# Altium schematic sheet ESC_Mounting.SchDoc
size B; Organization: ORGANIZATION; Address1: ADDRESS 1; Address2: ADDRESS 2; Address3: ADDRESS 3; Address4: ADDRESS 4; Revision: -; SheetNumber: 1; SheetTotal: 2; ENG_APP_DATE: --/--/--; DSN_APP_DATE: --/--/--; CHK_APP_DATE: --/--/--
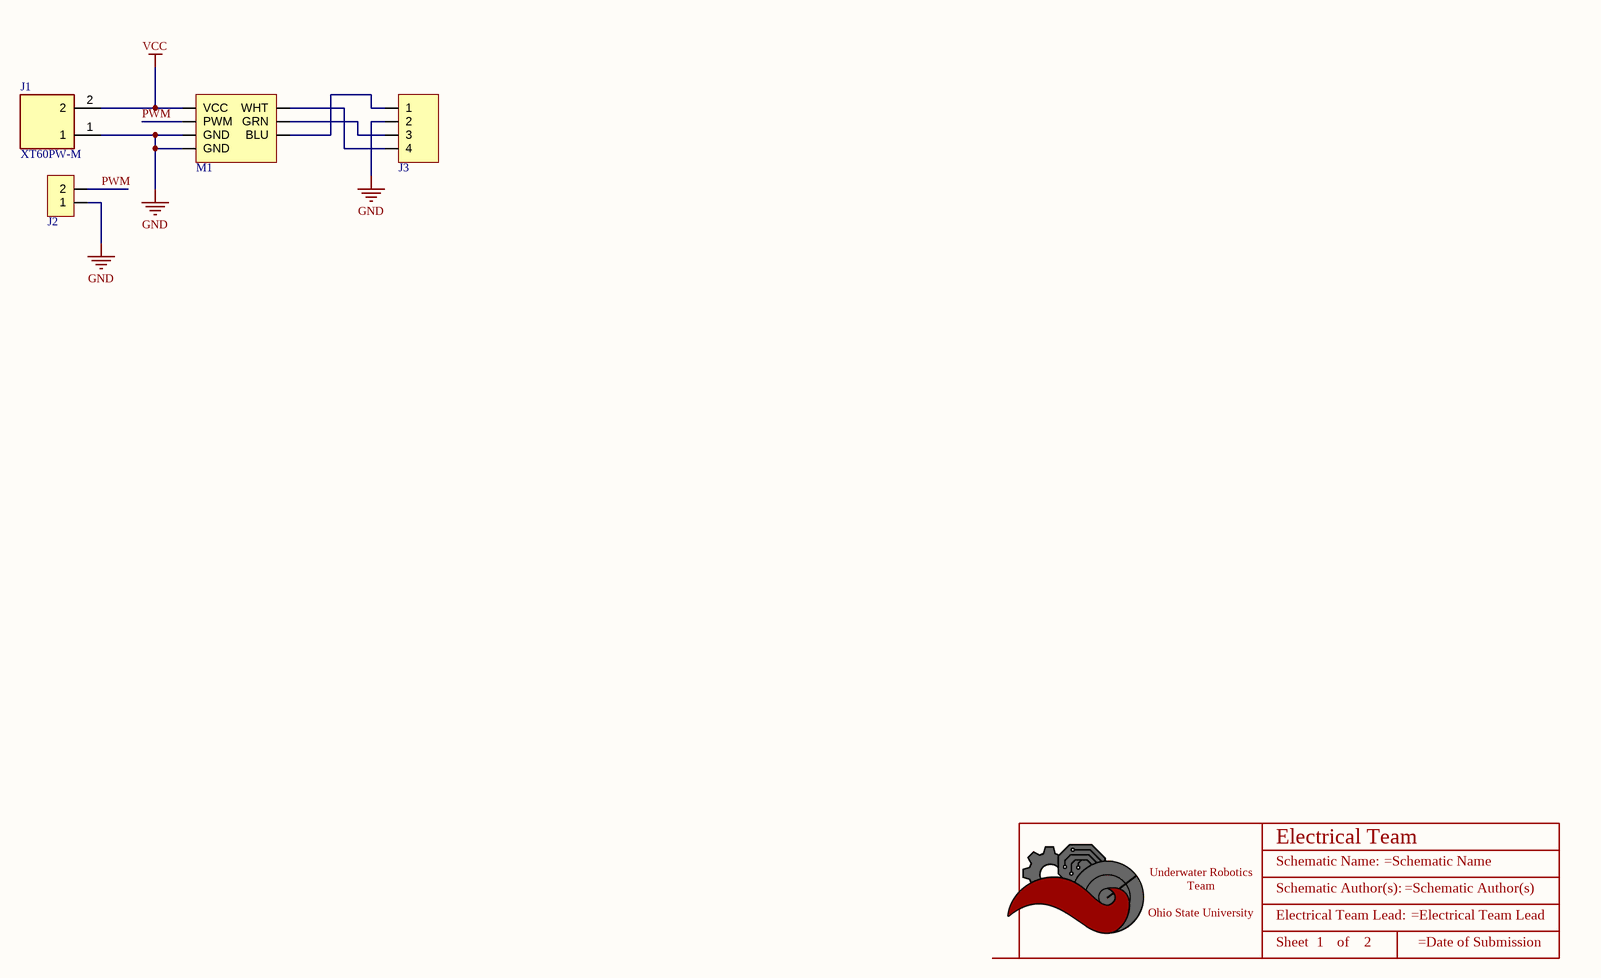
[diagram p0: ESC_Mounting.SchDoc]

## Parts
*  Title_Block  (value not drawn)  (graphical)
J1  XT60PW-M  [XT60_PW_AMASS_M]
J2  2 POS  [HEADER_2PIN_2.54MM]  (value not drawn)
J3  4 POS R/A  [CONN_MOLEX_MINIFIT JR_4 POS_R/A]  (value not drawn)
M1  Basic ESC  [BASIC_ESC]  (value not drawn)

## Nets
GND: J1.1 J2.1 J3.2 M1.1(GND) M1.2(GND)
VCC: J1.2 M1.4(VCC)
PWM: J2.2 M1.3(PWM)
NetJ3_1: J3.1 M1.5(BLU)
NetJ3_3: J3.3 M1.6(GRN)
NetJ3_4: J3.4 M1.7(WHT)

## Notes on the sheet
- DWG. NO.
- REV.
- SHT.
- THIS DOCUMENT AND THE DATA DISCLOSED HEREIN OR HEREWITH IS THE PROPERTY OF ALTIUM LIMITED AND MAY BE FREELY DISTRIBUTED IN WHOLE. NO RIGHTS ARE RESERVED OR EXPRESS OR IMPLIED WARANTEE GIVEN.
- REVISION
- DESCRIPTION
- DATE
- APPROVED
- ENG:
- APPROVALS
- PROJECT
- DSN:
- CHK:
- REFERENCE DOCUMENTS
- PROJECT REVISION:
- TITLE
- DOCUMENT REVISION:
- DESIGN ITEM:
- BOM:
- FAB DWG:
- PCB DWG:
- ASSY DWG:
- SCALE:
- SIZE
- B
- CAGE CODE
- FILE NAME
- DWG NO.
- SHEET
- OF
- REV
- (in symbol Title_Block) Electrical Team; Schematic Name:; Schematic Author(s):; Underwater Robotics Team / Ohio State University; Electrical Team Lead:; Sheet; of

## Library data of the parts
* = Title_Block: UWRT Schematic Title Block Template / Created June 2021, Dylan Trainor
J1 = XT60PW-M: XT60 60A Right Angle Male (30-45A MAX); MF: AMASS; SnapEDA_Link: https://www.snapeda.com/parts/XT60PW-M%20/AMASS/view-part/3075559/?ref=snap; MP: XT60PW-M; Availability: Unavailable; Price: None; Value: *; Package: Package Analog Devices
J2 = HEADER_2PIN_2.54MM: CONN HEADER VERT 2POS 2.54MM; Configuration: Vertical; Current Per Pin: 1A; Number of Positions: 2; Manufacturer: *; Pitch: 2.54mm; Color: Natural; Created By: Robert P; ComponentLink1Description: Datasheet; ComponentLink1URL: https://www.molex.com/pdm_docs/sd/026013115_sd.pdf; Series: *; Supplier 1: Digi-Key; Supplier Part Number 1: A121480-ND; Supplier 2: Mouser; Supplier Part Number 2: 571-5-146280-2
J3 = CONN_MOLEX_MINIFIT JR_4POS_R/A: Molex Minifit Jr. 5569 / 4 Pos R/A Natural; Pitch: 4.2mm; Configuration: Right Angle; Current Per Pin: 13A; Number of Positions: 4; Supplier Part Number 1: WM13112-ND; Supplier 1: Digi-Key; Manufacturer: Molex; Color: Natural; Created By: Flip B; ComponentLink1Description: Datasheet; ComponentLink1URL: https://www.molex.com/pdm_docs/sd/026013115_sd.pdf; Series: Minifit Jr 5569
M1 = BASIC_ESC: Blue Robotics Basic ESC / 7-26V Power, 30A, 5V PWM Signal; Manufacturer Part Number: BESC30-R3; Current: 30A Max; Created By: Flip B; Voltage: 7-26V; PWM Voltage: 5V; Manufacturer: Blue Robotics